# EAGLE design ADIS16209_v3 (EAGLE 9.5.0)
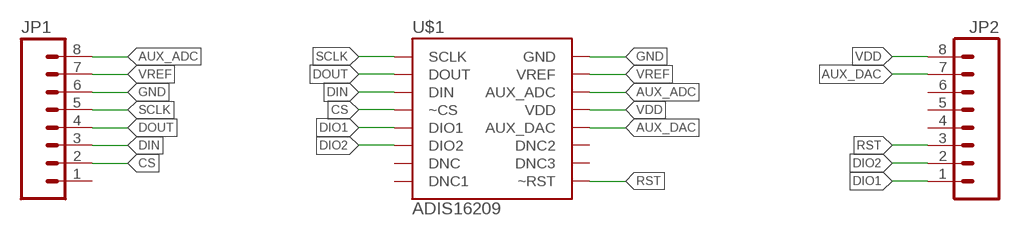
[diagram p0: schematic, sheet 1]

## Parts
JP1  M08  [1X08]
JP2  M08  [1X08]
U$1  ADIS16209  [CC-16-2]

## Nets
AUX_ADC: JP1.8 U$1.P$14(AUX_ADC)
AUX_DAC: JP2.7 U$1.P$12(AUX_DAC)
CS: JP1.2 U$1.P$4(~CS)
DIN: JP1.3 U$1.P$3(DIN)
DIO1: JP2.1 U$1.P$5(DIO1)
DIO2: JP2.2 U$1.P$6(DIO2)
DOUT: JP1.4 U$1.P$2(DOUT)
GND: JP1.6 U$1.P$16(GND)
RST: JP2.3 U$1.P$9(~RST)
SCLK: JP1.5 U$1.P$1(SCLK)
VDD: JP2.8 U$1.P$13(VDD)
VREF: JP1.7 U$1.P$15(VREF)
Unconnected: JP1.1 JP2.4 JP2.5 JP2.6 U$1.P$7(DNC) U$1.P$8(DNC1) U$1.P$10(DNC3) U$1.P$11(DNC2)

## Library data of the parts
JP1 JP2 = HyTechDevices:M08: Standard 8-pin 0.1" header. NOTES ON THE VARIANTS LOCK and LOCK_LONGPADS... This footprint was designed to help hold the alignment of a through-hole component (i.e. 6-pin header) while soldering it into place. You may notice that each hole has been shifted either up or down by 0.005 of an inch from it's more standard position (which is a perfectly straight line). This slight alteration caused the pins (the squares in the middle) to touch the edges of the holes. Because they are alternating, it causes a "brace" to hold the component in place. 0.005 has proven to be the perfect amount of "off-center" position when using our standard breakaway headers. Although looks a little odd when you look at the bare footprint, once you have a header in there, the alteration is very hard to notice. Also,if you push a header all the way into place, it is covered up entirely on the bottom side. This idea of altering the position of holes to aid alignment will be further integrated into the Sparkfun Library for other footprints. It can help hold any component with 3 or more connection pins. Note: The Sparkfun version includes many other packages including surface mount that may be of future interest. Source: Sparkfun <https://github.com/sparkfun/SparkFun-Eagle-Libraries>
U$1 = HyTechDevices:ADIS16209: Analog Devices ADIS16209 High Accuracy, Dual-Axis Digital Inclinometer and Accelerometer

## Board
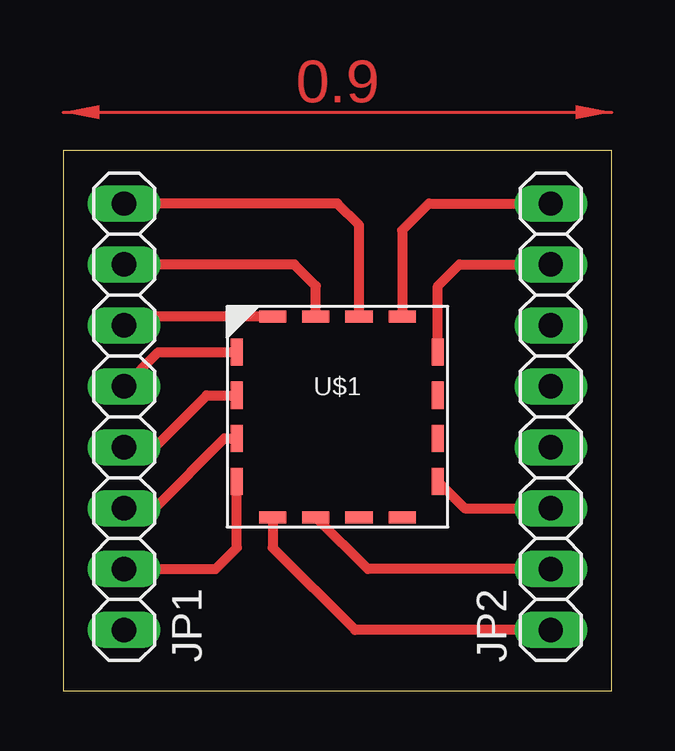
[diagram p1: board, top side]

Size 22.86 x 22.53 mm. Coordinates in mm from the lower left corner, seen from the top.
Outline: 0,0 22.86,0 22.86,22.53 0,22.53 0,0
Copper layers (1*16): Top 0.035mm / dielectric 1.5mm / Bottom 0.035mm
Design rules "DRC Advanced Circuits": minimum track width 6mil, minimum drill 10mil, track to track 6mil, track to pad 6mil, pad to pad 6mil, via to via 6mil, smd to smd 6mil, copper to edge 40mil, drill to drill 6mil, minimum pad ring 10mil, minimum via ring 8mil, stop-mask expansion 4mil, vias tented up to drill 0mil, thermal gap 10mil

### Footprints (pad centres in the part's own frame; a part is rotated, then mirrored left to right if it is on the bottom)
1X08 = drill 1.016 long: 1 -8.89,0; 2 -6.35,0; 3 -3.81,0; 4 -1.27,0; 5 1.27,0; 6 3.81,0; 7 6.35,0; 8 8.89,0
CC-16-2 = smd 0.5 x 1.127: P$1 -4.186,2.696; P$2 -4.186,0.898; P$3 -4.186,-0.898; P$4 -4.186,-2.696; P$9 4.186,-2.696; P$10 4.186,-0.898; P$11 4.186,0.898; P$12 4.186,2.696 | smd 1.127 x 0.5: P$5 -2.696,-4.186; P$6 -0.898,-4.186; P$7 0.898,-4.186; P$8 2.696,-4.186; P$13 2.696,4.186; P$14 0.898,4.186; P$15 -0.898,4.186; P$16 -2.696,4.186

### Placement (x,y rotation side)
JP1  2.54,11.43 90 top
JP2  20.32,11.43 90 top
U$1  11.43,11.43 0 top

### Tracks (layer width: path | path; a pad name or v marks a point on that pad's centre or on a via)
AUX_ADC
  Top 0.406: U$1.P$14 12.33,19.42 11.43,20.32 JP1.8
AUX_DAC
  Top 0.406: U$1.P$12 15.62,16.89 16.51,17.78 JP2.7
CS
  Top 0.406: JP1.2 6.35,5.08 7.24,5.97 U$1.P$4
DIN
  Top 0.406: JP1.3 3.81,7.62 6.72,10.53 U$1.P$3
DIO1
  Top 0.406: U$1.P$5 8.73,5.97 12.17,2.54 JP2.1
DIO2
  Top 0.406: JP2.2 12.7,5.08 U$1.P$6
DOUT
  Top 0.406: JP1.4 3.81,10.16 5.98,12.33 U$1.P$2
GND
  Top 0.406: U$1.P$16 2.92,15.62 JP1.6
RST
  Top 0.406: U$1.P$9 16.73,7.62 JP2.3
SCLK
  Top 0.406: U$1.P$1 3.97,14.12 JP1.5
VDD
  Top 0.406: JP2.8 15.24,20.32 14.12,19.21 U$1.P$13
VREF
  Top 0.406: U$1.P$15 10.53,16.89 9.64,17.78 JP1.7
(copper drawn outside any net)
  shapes: Top area x1